# EAGLE design PCB1a_Adapter (EAGLE 9.6.2)
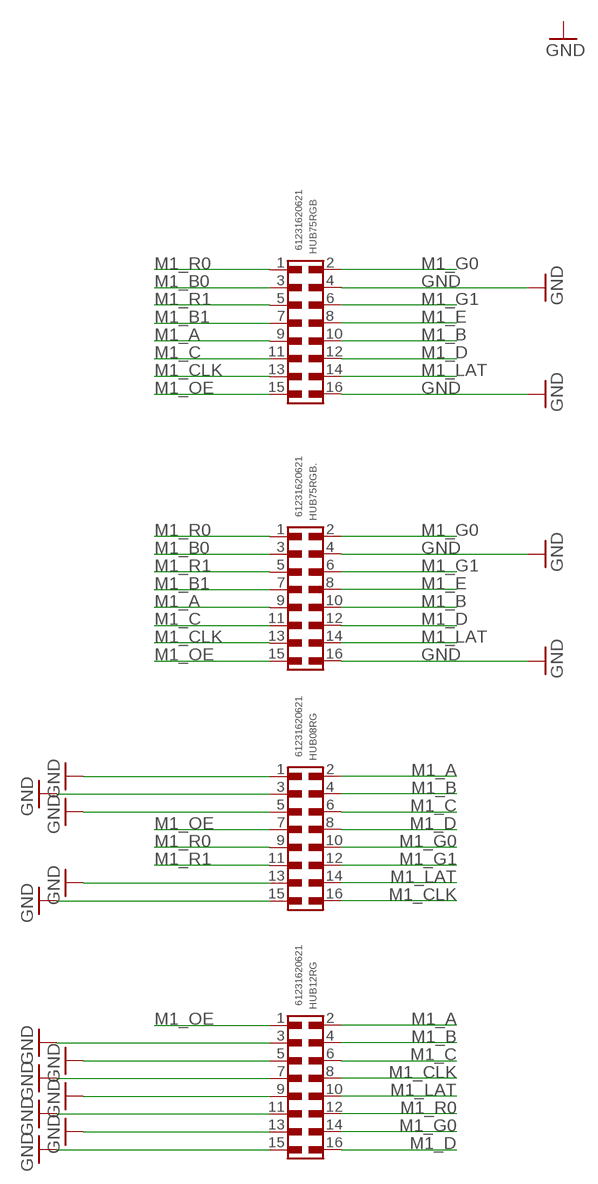
[diagram p0: schematic, sheet 1]

## Parts
HUB08RG  61231620621  6123XX20621_61231620621  [61231620621]
HUB12RG  61231620621  6123XX20621_61231620621  [61231620621]
HUB75RGB  61231620621  6123XX20621_61231620621  [61231620621]
HUB75RGB.  61231620621  6123XX20621_61231620621  [61231620621]

## Nets
GND: HUB08RG.1 HUB08RG.3 HUB08RG.5 HUB08RG.13 HUB08RG.15 HUB12RG.3 HUB12RG.5 HUB12RG.7 HUB12RG.9 HUB12RG.11 HUB12RG.13 HUB12RG.15 HUB75RGB.4 HUB75RGB.16 HUB75RGB..4 HUB75RGB..16
M1_A: HUB08RG.2 HUB12RG.2 HUB75RGB.9 HUB75RGB..9
M1_B: HUB08RG.4 HUB12RG.4 HUB75RGB.10 HUB75RGB..10
M1_B0: HUB75RGB.3 HUB75RGB..3
M1_B1: HUB75RGB.7 HUB75RGB..7
M1_C: HUB08RG.6 HUB12RG.6 HUB75RGB.11 HUB75RGB..11
M1_CLK: HUB08RG.16 HUB12RG.8 HUB75RGB.13 HUB75RGB..13
M1_D: HUB08RG.8 HUB12RG.16 HUB75RGB.12 HUB75RGB..12
M1_E: HUB75RGB.8 HUB75RGB..8
M1_G0: HUB08RG.10 HUB12RG.14 HUB75RGB.2 HUB75RGB..2
M1_G1: HUB08RG.12 HUB75RGB.6 HUB75RGB..6
M1_LAT: HUB08RG.14 HUB12RG.10 HUB75RGB.14 HUB75RGB..14
M1_OE: HUB08RG.7 HUB12RG.1 HUB75RGB.15 HUB75RGB..15
M1_R0: HUB08RG.9 HUB12RG.12 HUB75RGB.1 HUB75RGB..1
M1_R1: HUB08RG.11 HUB75RGB.5 HUB75RGB..5

## Library data of the parts
HUB08RG HUB12RG HUB75RGB HUB75RGB. = Wurth_Connectors_WR-BHD:6123XX20621_61231620621: WR-BHD 2.54 mm Male SMT Box Header Material Properties: Insulator Material PA 9T; PA9T Insulator Flammability Rating UL94 V-0 Color Black Contact Material Copper Alloy Contact Plating Gold Contact Type Stamped General Information Operating Temperature -40 up to +125 °C Compliance RoHS Working Voltage 250 V (AC) Withstanding Voltage 500 V (AC) Contact Resistance 20 mΩ RISO 1000 MΩ Pitch 2.54 mm Gender Male Certification UL Approval E323964 Packaging Properties Packaging Tape and Reel with Cap <https://www.we-online.com/components/media/o32919v209%20Family_WR-BHD_612xxx20621.jpg> Details see: www.we-online.com/en/components/products/BHD_2_54_SMT_MALE_BOX_HEADER_6120XX20621 <www.we-online.com/catalog/BHD_2_54_SMT_MALE_BOX_HEADER_6120XX20621/?utm_source=eagle_model&utm_medium=description_link&utm_campaign=eisos_eagle> Updated by Ella Wu 2022-09-06 2022 (C) Würth Elektronik; CONTACT-RESISTANCE: 20mOhm; DATASHEET-URL: https://www.we-online.com/redexpert/spec/61231620621?ae; GENDER: Male; IR: 3A; LENGTH: 27.94mm; MOUNT: SMT; PACKAGING: Tape and Reel with Cap; PART-NUMBER: 61231620621; PINS: 16; PITCH: 2.54mm; TYPE: Straight; WORKING-VOLTAGE: 250V(AC)

## Net classes
1 power: width 0.305 mm
2 lowpower: width 0.305 mm, drill 0.483 mm

## Board
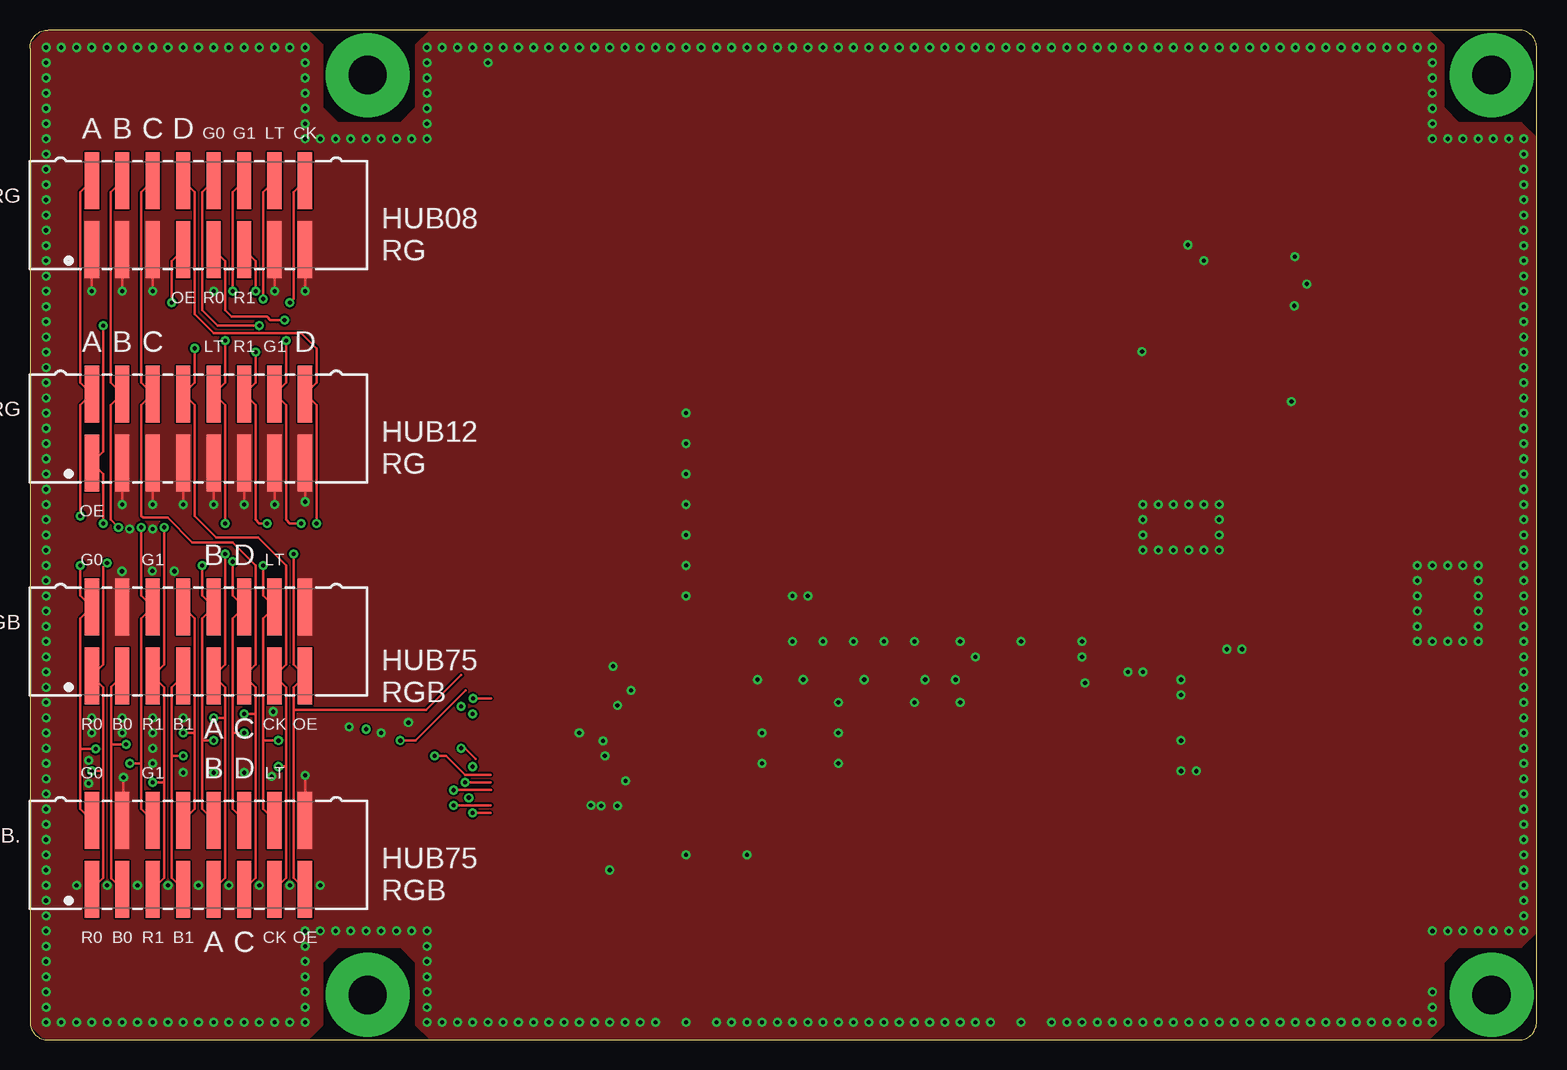
[diagram p1: board, top side]
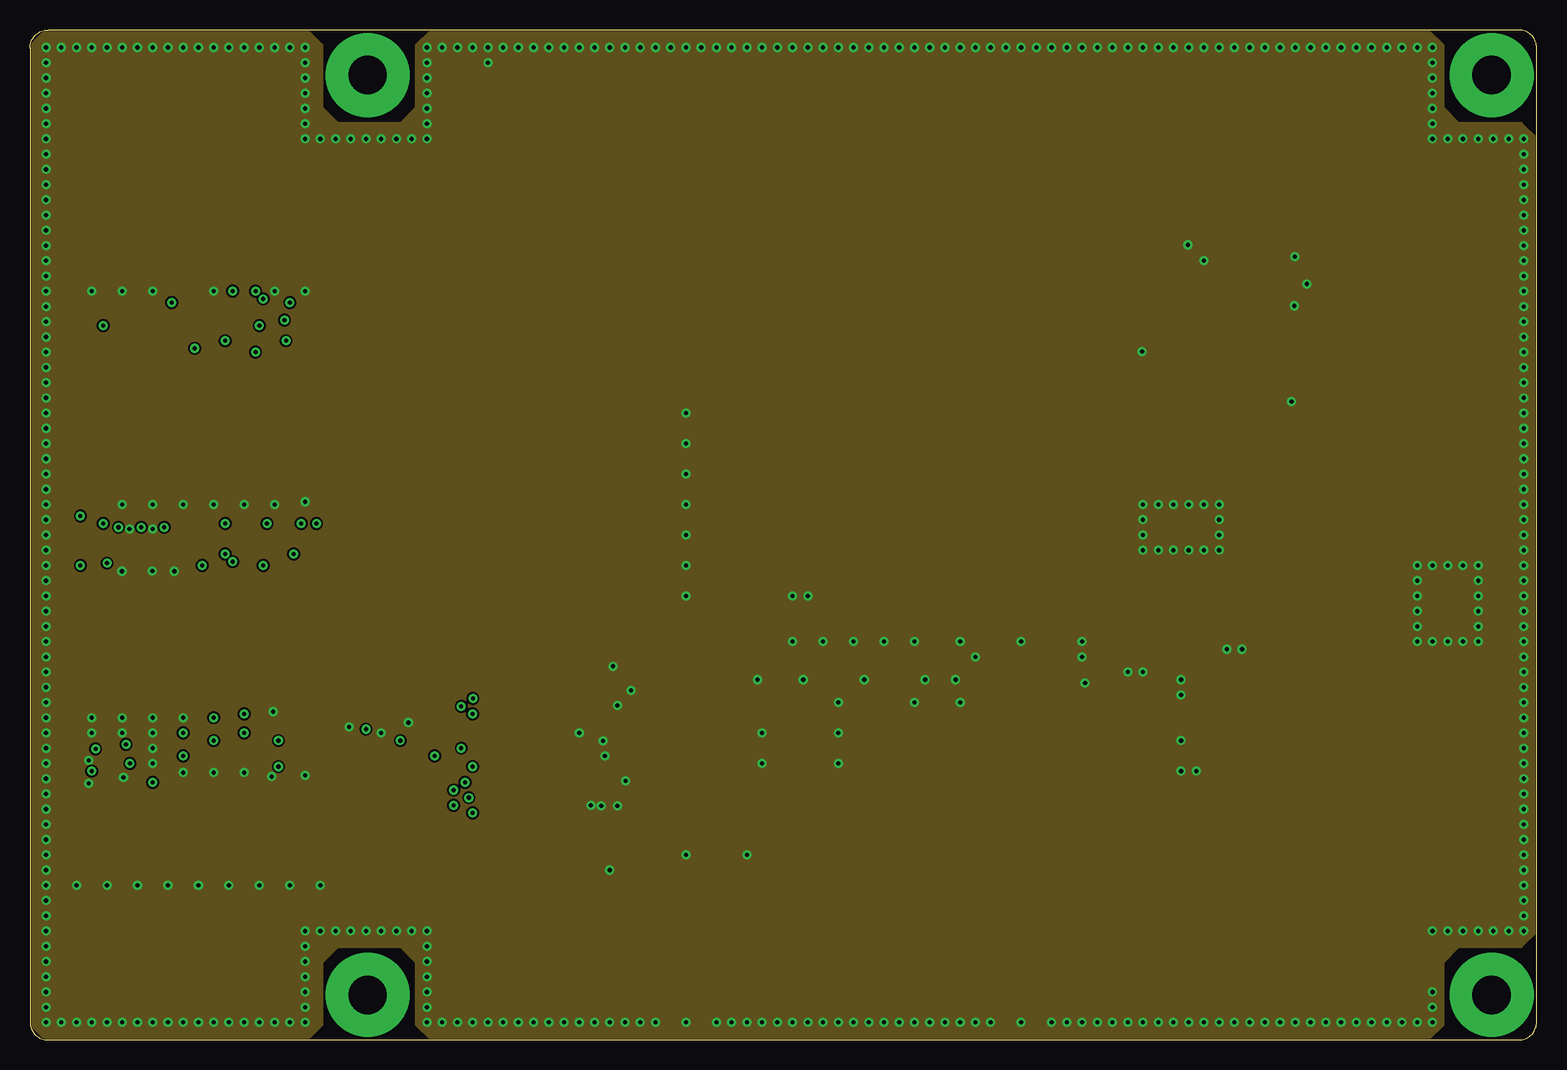
[diagram p2: board, inner layer Route2]
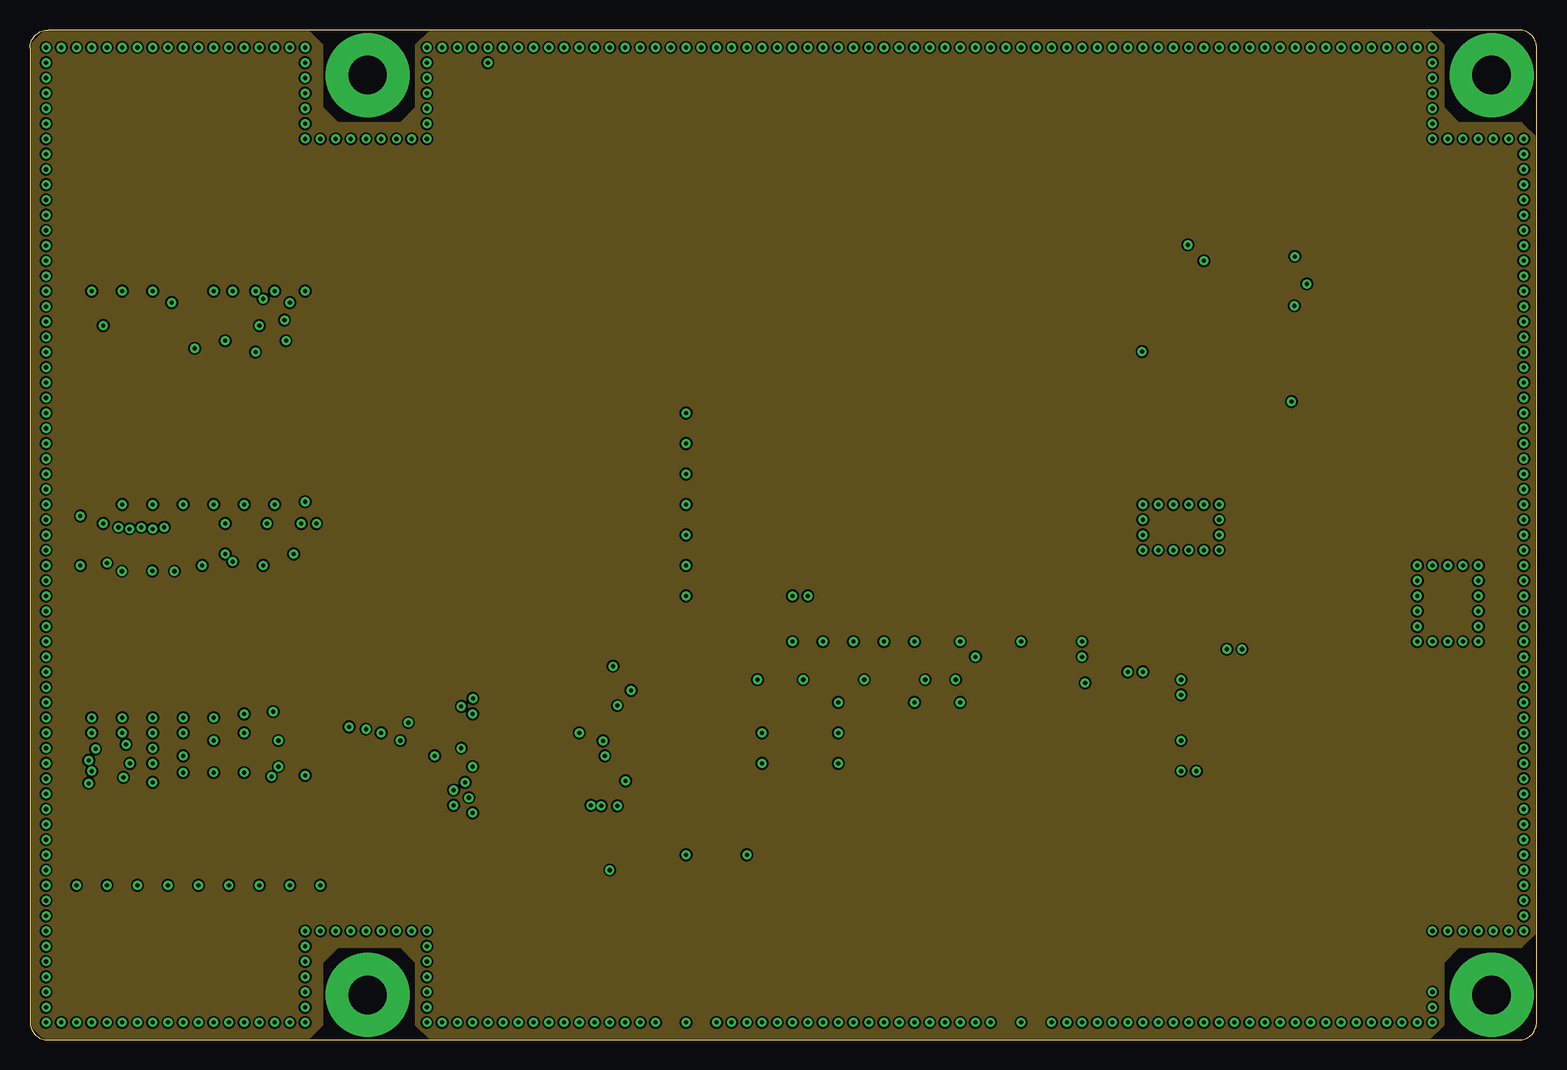
[diagram p3: board, inner layer Route15]
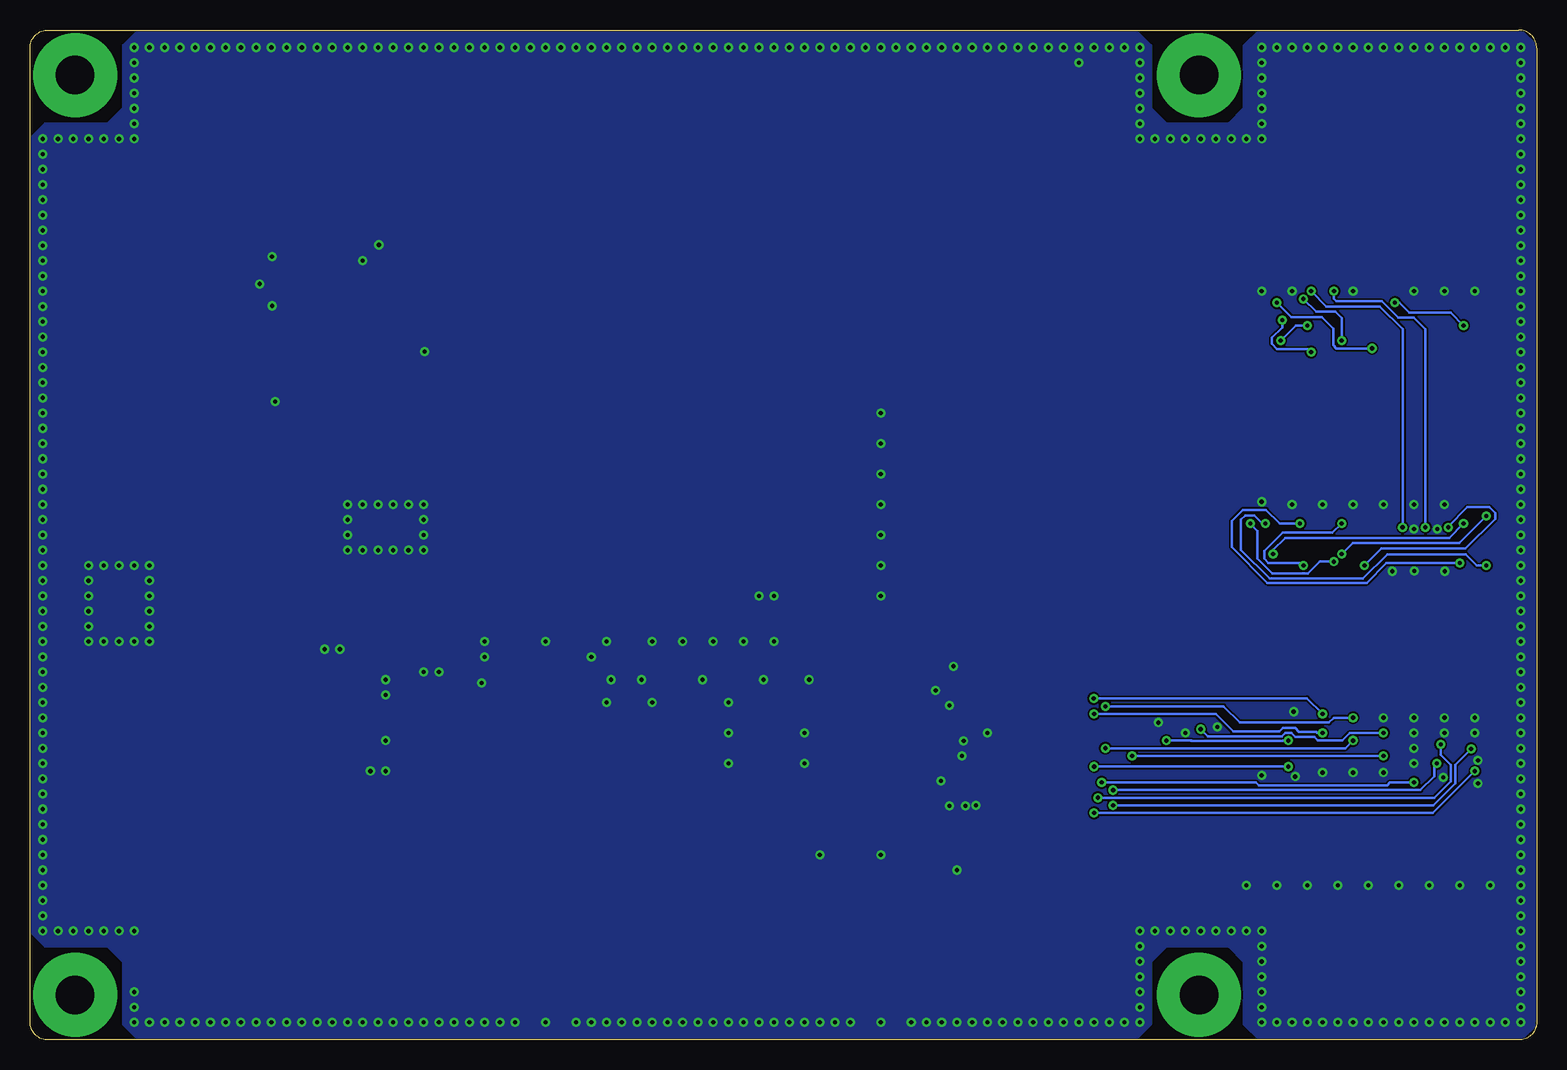
[diagram p4: board, bottom side, seen from below]

Size 125.6 x 84.2 mm. Coordinates in mm from the lower left corner, seen from the top.
Outline: 0,82.7 0,1.5 arc90 1.5,0 124.1,0 arc90 125.6,1.5 125.6,82.7 arc90 124.1,84.2 1.5,84.2 arc90 0,82.7
Copper layers (1*16): Top 0.035mm / dielectric 0.36mm / Bottom 0.035mm
Design rules "default *": minimum track width 6mil, minimum drill 0.35mm, track to track 6mil, track to pad 6mil, pad to pad 6mil, via to via 6mil, smd to smd 6mil, copper to edge 3mil, drill to drill 6mil, minimum pad ring 10mil, minimum via ring 8mil, stop-mask expansion 4mil, vias tented up to drill 15mil, thermal gap 10mil

### Footprints (pad centres in the part's own frame; a part is rotated, then mirrored left to right if it is on the bottom)
61231620621 = smd 1.2 x 4.75: 1 -8.89,-2.875; 2 -8.89,2.875; 3 -6.35,-2.875; 4 -6.35,2.875; 5 -3.81,-2.875; 6 -3.81,2.875; 7 -1.27,-2.875; 8 -1.27,2.875; 9 1.27,-2.875; 10 1.27,2.875; 11 3.81,-2.875; 12 3.81,2.875; 13 6.35,-2.875; 14 6.35,2.875; 15 8.89,-2.875; 16 8.89,2.875

### Placement (x,y rotation side)
HUB08RG  14.04,68.77 0 top
HUB12RG  14.04,50.99 0 top
HUB75RGB  14.04,33.21 0 top
HUB75RGB.  14.04,15.43 0 top

### Tracks (layer width: path | path; a pad name or v marks a point on that pad's centre or on a via)
+5V
  pour Route15: 119.12,7.75 124.33,7.75 125.6,9.02 125.6,75.18 124.33,76.45 119.12,76.45 117.85,77.72 117.85,82.93 116.58,84.2 33.42,84.2 32.15,82.93 32.15,77.72 30.88,76.45 25.67,76.45 24.4,77.72 24.4,82.93 23.13,84.2 1.27,84.2 0,82.93 0,1.27 1.27,0 23.13,0 24.4,1.27 24.4,6.48 25.67,7.75 30.88,7.75 32.15,6.48 32.15,1.27 33.42,0 116.58,0 117.85,1.27 117.85,6.48
GND  (via drill 0.35)
  Top 0.203: v7.79,21.88 7.79,18.41 HUB75RGB..4 | HUB75RGB..16 v22.93,22.06 | HUB08RG.1 v5.15,62.42 | HUB08RG.3 v7.69,62.42 | HUB08RG.5 v10.23,62.42 | HUB08RG.15 v22.93,62.42 | HUB08RG.13 v20.39,62.42 | HUB12RG.3 v7.69,44.64 | HUB12RG.15 v22.93,44.87 | HUB12RG.13 v20.39,44.64 | HUB12RG.11 v17.85,44.64 | HUB12RG.9 v15.31,44.64 | HUB12RG.7 v12.77,44.64 | HUB12RG.5 v10.23,44.64
  other vias: 105.16,53.21 97.86,64.96 61.03,25.59 61.03,23.05 67.38,23.05 67.38,25.59 67.38,28.13 77.54,28.13 73.73,28.13 63.57,33.21 63.57,37.02 1.34,82.74 2.61,82.74 3.88,82.74 5.15,82.74 6.42,82.74 7.69,82.74 8.96,82.74 10.23,82.74 11.5,82.74 12.77,82.74 14.04,82.74 15.31,82.74 16.58,82.74 17.85,82.74 22.93,82.74 21.66,82.74 20.39,82.74 19.12,82.74 33.09,82.74 34.36,82.74 35.63,82.74 36.9,82.74 38.17,82.74 39.44,82.74 40.71,82.74 41.98,82.74 43.25,82.74 44.52,82.74 45.79,82.74 47.06,82.74 48.33,82.74 49.6,82.74 1.34,81.47 1.34,80.2 1.34,78.93 1.34,77.66 1.34,76.39 1.34,75.12 60.65,30.04 64.46,30.04 69.54,30.04 74.62,30.04 77.16,30.04 47.77,24.93 45.79,25.59 47.92,23.69 5.15,25.59 5.15,26.86 7.69,26.86 7.69,25.59 10.23,25.59 10.23,26.86 12.77,26.86 10.23,24.32 10.23,23.05 12.77,22.29 15.31,22.29 17.85,22.29 20.14,21.96 48.97,27.88 66.11,33.21 68.65,33.21 71.19,33.21 73.73,33.21 77.54,33.21 78.81,31.94 50.11,29.15 48.61,31.15 64.84,37.02 92.78,44.64 92.78,43.37 92.78,42.1 92.78,40.83 94.05,40.83 99.13,40.83 99.13,42.1 99.13,43.37 99.13,44.64 97.86,44.64 96.59,44.64 95.32,44.64 94.05,44.64 95.32,40.83 96.59,40.83 97.86,40.83 115.64,34.48 115.64,35.75 115.64,37.02 115.64,38.29 115.64,39.56 116.91,39.56 118.18,39.56 119.45,39.56 120.72,39.56 120.72,38.29 120.72,37.02 120.72,35.75 120.72,34.48 120.72,33.21 119.45,33.21 118.18,33.21 116.91,33.21 115.64,33.21 50.87,82.74 52.14,82.74 53.41,82.74 54.68,82.74 55.95,82.74 57.22,82.74 58.49,82.74 59.76,82.74 61.03,82.74 62.3,82.74 63.57,82.74 64.84,82.74 66.11,82.74 67.38,82.74 86.43,82.74 87.7,82.74 88.97,82.74 90.24,82.74 91.51,82.74 92.78,82.74 94.05,82.74 95.32,82.74 96.59,82.74 97.86,82.74 99.13,82.74 100.4,82.74 101.67,82.74 102.94,82.74 68.65,82.74 69.92,82.74 71.19,82.74 72.46,82.74 73.73,82.74 75,82.74 76.27,82.74 77.54,82.74 78.81,82.74 80.08,82.74 81.35,82.74 82.62,82.74 83.89,82.74 85.16,82.74 104.21,82.74 105.48,82.74 106.75,82.74 108.02,82.74 109.29,82.74 110.56,82.74 111.83,82.74 113.1,82.74 114.37,82.74 115.64,82.74 116.91,82.74 22.93,81.47 22.93,80.2 22.93,78.93 22.93,77.66 22.93,76.39 33.09,81.47 33.09,80.2 33.09,78.93 33.09,77.66 33.09,76.39 33.09,75.12 31.82,75.12 30.55,75.12 29.28,75.12 28.01,75.12 26.74,75.12 25.47,75.12 24.2,75.12 22.93,75.12 28.01,9.08 29.28,9.08 30.55,9.08 31.82,9.08 33.09,9.08 33.09,7.81 33.09,6.54 33.09,5.27 22.93,6.54 22.93,7.81 22.93,9.08 24.2,9.08 25.47,9.08 26.74,9.08 22.93,5.27 22.93,4 22.93,2.73 22.93,1.46 21.66,1.46 20.39,1.46 33.09,1.46 34.36,1.46 35.63,1.46 33.09,2.73 33.09,4 4.9,21.4 4.9,23.3 6.42,12.89 11.5,12.89 16.58,12.89 19.12,12.89 21.66,12.89 24.2,12.89 3.88,12.89 8.96,12.89 14.04,12.89 19.12,1.46 17.85,1.46 1.34,1.46 1.34,2.73 1.34,4 1.34,5.27 36.9,1.46 38.17,1.46 39.44,1.46 40.71,1.46 41.98,1.46 43.25,1.46 44.52,1.46 45.79,1.46 47.06,1.46 48.33,1.46 49.6,1.46 50.87,1.46 52.14,1.46 54.68,1.46 57.22,1.46 58.49,1.46 59.76,1.46 61.03,1.46 62.3,1.46 63.57,1.46 64.84,1.46 66.11,1.46 67.38,1.46 86.43,1.46 87.7,1.46 88.97,1.46 90.24,1.46 91.51,1.46 92.78,1.46 94.05,1.46 95.32,1.46 96.59,1.46 97.86,1.46 99.13,1.46 100.4,1.46 101.67,1.46 102.94,1.46 68.65,1.46 69.92,1.46 71.19,1.46 72.46,1.46 73.73,1.46 75,1.46 76.27,1.46 77.54,1.46 78.81,1.46 80.08,1.46 82.62,1.46 85.16,1.46 104.21,1.46 105.48,1.46 106.75,1.46 108.02,1.46 109.29,1.46 110.56,1.46 111.83,1.46 113.1,1.46 114.37,1.46 115.64,1.46 16.58,1.46 15.31,1.46 14.04,1.46 12.77,1.46 2.61,1.46 3.88,1.46 1.34,6.54 1.34,7.81 1.34,9.08 1.34,10.35 1.34,11.62 1.34,12.89 1.34,14.16 1.34,15.43 1.34,16.7 1.34,17.97 1.34,19.24 1.34,20.51 1.34,21.78 1.34,23.05 1.34,24.32 1.34,25.59 1.34,44.64 1.34,45.91 1.34,47.18 1.34,48.45 1.34,49.72 1.34,50.99 1.34,52.26 1.34,53.53 1.34,54.8 1.34,56.07 1.34,57.34 1.34,58.61 1.34,59.88 1.34,61.15 1.34,26.86 1.34,28.13 1.34,29.4 1.34,30.67 1.34,31.94 1.34,33.21 1.34,34.48 1.34,35.75 1.34,37.02 1.34,38.29 1.34,39.56 1.34,40.83 1.34,42.1 1.34,43.37 1.34,62.42 1.34,63.69 1.34,64.96 1.34,66.23 1.34,67.5 1.34,68.77 1.34,70.04 1.34,71.31 1.34,72.58 1.34,73.85 11.5,1.46 10.23,1.46 8.96,1.46 7.69,1.46 6.42,1.46 5.15,1.46 118.18,9.08 119.45,9.08 120.72,9.08 121.99,9.08 123.26,9.08 116.91,2.73 116.91,1.46 116.91,4 116.91,9.08 124.53,9.08 124.53,10.35 124.53,11.62 124.53,12.89 124.53,14.16 124.53,15.43 124.53,16.7 124.53,17.97 124.53,19.24 124.53,20.51 124.53,21.78 124.53,23.05 124.53,24.32 124.53,25.59 124.53,26.86 124.53,28.13 124.53,29.4 124.53,30.67 124.53,49.72 124.53,50.99 124.53,52.26 124.53,53.53 124.53,54.8 124.53,56.07 124.53,57.34 124.53,58.61 124.53,59.88 124.53,61.15 124.53,62.42 124.53,63.69 124.53,64.96 124.53,66.23 124.53,31.94 124.53,33.21 124.53,34.48 124.53,35.75 124.53,37.02 124.53,38.29 124.53,39.56 124.53,40.83 124.53,42.1 124.53,43.37 124.53,44.64 124.53,45.91 124.53,47.18 124.53,48.45 124.53,67.5 124.53,68.77 124.53,70.04 124.53,71.31 124.53,72.58 124.53,73.85 124.53,75.12 116.91,81.47 123.26,75.12 121.99,75.12 120.72,75.12 116.91,80.2 116.91,78.93 116.91,77.66 116.91,76.39 116.91,75.12 118.18,75.12 119.45,75.12 99.77,32.58 101.03,32.58 95.95,28.77 95.95,30.04 87.7,31.94 95.95,24.96 97.22,22.42 95.95,22.42 8.3,42.61 10.23,42.61 10.2,39.1 12.03,39.08 7.66,39.08 29.28,25.59 31.54,26.45 26.61,26.1 20.26,27.37 106.45,63.03 105.43,65.32 105.4,61.2 92.7,57.39 96.51,66.28 87.95,29.76 46.76,19.54 47.62,19.52 48.97,19.52 49.65,21.6 54.68,52.26 54.68,49.72 54.68,47.18 54.68,44.64 54.68,42.1 54.68,39.56 54.68,37.02 54.68,15.43 59.76,15.43 48.33,14.16 38.17,81.47 82.62,33.21 87.7,33.21 15.31,62.42 92.78,30.67 91.51,30.67
  pour Bottom: 119.12,7.75 124.33,7.75 125.6,9.02 125.6,75.18 124.33,76.45 119.12,76.45 117.85,77.72 117.85,82.93 116.58,84.2 33.42,84.2 32.15,82.93 32.15,77.72 30.88,76.45 25.67,76.45 24.4,77.72 24.4,82.93 23.13,84.2 1.27,84.2 0,82.93 0,1.27 1.27,0 23.13,0 24.4,1.27 24.4,6.48 25.67,7.75 30.88,7.75 32.15,6.48 32.15,1.27 33.42,0 116.58,0 117.85,1.27 117.85,6.48
  pour Top: 119.12,7.75 124.33,7.75 125.6,9.02 125.6,75.18 124.33,76.45 119.12,76.45 117.85,77.72 117.85,82.93 116.58,84.2 33.42,84.2 32.15,82.93 32.15,77.72 30.88,76.45 25.67,76.45 24.4,77.72 24.4,82.93 23.13,84.2 1.27,84.2 0,82.93 0,1.27 1.27,0 23.13,0 24.4,1.27 24.4,6.48 25.67,7.75 30.88,7.75 32.15,6.48 32.15,1.27 33.42,0 116.58,0 117.85,1.27 117.85,6.48
  pour Route2: 119.12,7.75 124.33,7.75 125.6,9.02 125.6,75.18 124.33,76.45 119.12,76.45 117.85,77.72 117.85,82.93 116.58,84.2 33.42,84.2 32.15,82.93 32.15,77.72 30.88,76.45 25.67,76.45 24.4,77.72 24.4,82.93 23.13,84.2 1.27,84.2 0,82.93 0,1.27 1.27,0 23.13,0 24.4,1.27 24.4,6.48 25.67,7.75 30.88,7.75 32.15,6.48 32.15,1.27 33.42,0 116.58,0 117.85,1.27 117.85,6.48
M1_A  (via drill 0.35)
  Top 0.203: HUB75RGB..9 16.26,13.51 16.26,26.86 | 16.26,26.86 16.26,29.38 HUB75RGB.9 16.26,31.29 v16.26,40.51 | v35.95,27.82 v35.95,27.81 | v15.31,26.86 16.26,26.86 | HUB08RG.2 4.2,70.69 4.2,54.82 HUB12RG.2 4.2,52.91 v4.2,43.69
  Bottom 0.203: v15.31,26.86 16.93,26.86 17.32,26.47 24.76,26.47 26.1,27.81 v35.95,27.81 | v4.2,43.69 6.45,41.43 15.34,41.43 v16.26,40.51
M1_B  (via drill 0.35)
  Top 0.203: HUB75RGB..10 14.36,19.26 14.36,24.96 | 14.36,24.96 14.36,35.13 HUB75RGB.10 14.36,37.04 v14.36,39.56 | 37.15,23.44 36.27,24.32 v35.95,24.32 | v15.31,24.96 14.36,24.96 | HUB08RG.4 6.74,70.69 6.74,54.82 HUB12RG.4 6.74,52.91 6.74,43.37 v7.37,42.73
  Bottom 0.203: v35.95,24.32 15.95,24.32 v15.31,24.96 | v7.37,42.73 7.37,42.82 5.77,44.42 3.95,44.42 3.46,43.94 3.46,43.44 5.94,40.96 12.96,40.96 v14.36,39.56
M1_B0  (via drill 0.35)
  Top 0.203: HUB75RGB..3 6.79,13.46 6.79,24.64 | HUB75RGB.3 6.79,29.43 6.79,24.64 | v36.59,20.19 v36.58,20.19 | v8.01,24.64 6.79,24.64
  Bottom 0.203: v36.58,20.19 8.52,20.19 7.16,21.55 7.16,22.92 8.01,23.77 v8.01,24.64
M1_B1  (via drill 0.35)
  Top 0.203: HUB75RGB..7 11.82,13.51 11.82,23.69 | HUB75RGB.7 11.82,29.38 11.82,23.69 | 38.39,22.1 36.27,22.1 34.68,23.69 v33.73,23.69 | v12.77,23.69 11.82,23.69
  Bottom 0.203: v33.73,23.69 v12.77,23.69
M1_C  (via drill 0.35)
  Top 0.203: HUB75RGB..11 18.8,13.51 18.8,27.18 | 18.8,27.18 18.8,29.38 HUB75RGB.11 18.8,31.29 18.8,39.56 16.9,41.47 13.54,41.47 11.46,43.55 9.42,43.55 9.28,43.69 9.28,52.91 HUB12RG.6 9.28,54.82 9.28,70.69 HUB08RG.6 | 38.42,28.47 v36.92,28.47 | v17.85,27.18 18.8,27.18
  Bottom 0.203: v36.92,28.47 19.15,28.47 v17.85,27.18
M1_CLK  (via drill 0.35)
  Top 0.203: HUB75RGB..13 21.34,13.51 21.34,22.79 | 21.34,22.79 21.34,29.38 HUB75RGB.13 21.34,31.29 21.34,39.56 19.01,41.9 15.51,41.9 13.72,43.69 13.72,52.91 HUB12RG.8 13.72,54.82 v13.72,57.66 | v20.71,22.79 21.34,22.79 | HUB08RG.16 21.98,70.69 21.98,61.78 v21.66,61.47
  Bottom 0.203: v36.9,22.79 v20.71,22.79 | v21.66,61.47 20.45,60.26 17.91,60.26 16.95,59.29 16.95,57.91 16.69,57.66 v13.72,57.66
M1_D  (via drill 0.35)
  Top 0.203: HUB75RGB..12 16.9,19.26 16.9,25.59 | 16.9,25.59 16.9,35.13 HUB75RGB.12 16.9,37.04 16.9,39.88 v16.91,39.87 | v36.91,27.17 v36.9,27.18 | v17.85,25.59 16.9,25.59 | HUB08RG.8 13.72,70.69 13.72,60.52 15.31,58.93 22.61,58.93 23.88,57.66 23.88,54.82 HUB12RG.16 23.88,52.91 v23.88,43.05
  Bottom 0.203: v36.9,27.18 26.74,27.18 25.27,25.7 21.47,25.7 21.18,25.99 20.13,25.99 19.82,25.68 18.37,25.68 18.28,25.59 v17.85,25.59 | v16.91,39.87 18.09,39.87 19.06,38.9 22.04,38.9 23.27,40.13 23.27,42.44 v23.88,43.05
M1_E  (via drill 0.35)
  Top 0.203: HUB75RGB..8 13.72,19.26 13.72,25.59 | HUB75RGB.8 13.72,35.13 13.72,25.59 | v12.77,25.59 13.72,25.59
  Bottom 0.203: v28.01,25.91 27.4,25.3 21.26,25.3 20.97,25.59 20.45,25.59 20.13,25.27 18.55,25.27 18.24,24.96 16.2,24.96 15.57,25.59 v12.77,25.59
M1_G0  (via drill 0.35)
  Top 0.203: HUB75RGB..2 4.2,19.26 4.2,24.26 | 4.2,24.26 4.2,35.13 HUB75RGB.2 4.2,37.04 v4.2,39.56 | 38.41,19.56 v35.31,19.56 | v5.47,24.26 4.2,24.26 | HUB08RG.10 14.36,70.69 14.36,60.83 15.63,59.56 v19.12,59.56 | v21.34,58.29 21.34,54.82 HUB12RG.14 21.34,52.91 21.34,43.37 21.66,43.05 v22.61,43.05
  Bottom 0.203: v5.47,24.26 6.78,22.95 6.78,21.4 8.62,19.56 v35.31,19.56 | v19.12,59.56 20.07,59.56 v21.34,58.29 | v22.61,43.05 22.87,43.05 23.55,43.73 24.29,43.73 24.64,43.38 24.64,40.85 22.27,38.47 14.49,38.47 12.47,40.48 5.92,40.48 4.99,39.56 v4.2,39.56
M1_G1  (via drill 0.35)
  Top 0.203: HUB75RGB..6 9.28,19.26 9.28,23.05 | 9.28,23.05 9.28,35.13 HUB75RGB.6 9.28,37.04 v9.28,42.73 | 38.42,20.83 v35.31,20.83 | v8.33,23.05 9.28,23.05 | HUB08RG.12 16.9,70.69 v16.9,62.42
  Bottom 0.203: v8.33,23.05 8.56,22.82 8.56,21.96 9.69,20.83 v35.31,20.83 | v16.9,62.42 16.9,61.78 16.71,61.59 12.93,61.59 11.55,60.21 10.24,60.21 9.28,59.25 v9.28,42.73
M1_LAT  (via drill 0.35)
  Top 0.203: HUB75RGB..14 19.44,19.26 19.44,24.96 | 19.44,24.96 19.44,35.13 HUB75RGB.14 19.44,37.04 v19.44,39.56 | HUB08RG.14 19.44,70.69 19.44,61.78 v19.45,61.78 | 36.3,29.12 32.14,24.96 v30.87,24.96 | v20.71,24.96 19.44,24.96 | v16.26,58.29 16.26,54.82 HUB12RG.10 16.26,52.91 v16.26,43.05
  Bottom 0.203: v19.45,61.78 18.37,60.7 16.77,60.7 16.26,60.2 v16.26,58.29 | v16.26,43.05 17.02,42.29 21.18,42.29 22.71,40.76 22.71,40.13 22.36,39.78 19.66,39.78 v19.44,39.56 | v30.87,24.96 28.79,24.96 28.78,24.94 21.15,24.94 21.13,24.96 v20.71,24.96
M1_OE  (via drill 0.35)
  Top 0.203: HUB75RGB..15 21.98,13.51 21.98,27.51 | 21.98,27.51 21.98,29.38 HUB75RGB.15 21.98,31.29 v21.98,40.51 | HUB08RG.7 11.82,64.94 v11.82,61.47 | 21.98,27.51 33.04,27.51 35.95,30.42 | v6.1,59.56 6.1,49.07 HUB12RG.1 6.1,47.16 v6.1,43.05
  Bottom 0.203: v11.82,61.47 11.44,61.47 10.61,60.64 7.18,60.64 v6.1,59.56 | v6.1,43.05 7.29,41.86 20.95,41.86 21.98,40.83 v21.98,40.51
M1_R0  (via drill 0.35)
  Top 0.203: HUB75RGB..1 6.1,13.51 6.1,22.42 | 6.1,22.42 6.1,29.38 HUB75RGB.1 6.1,31.29 6.1,39.43 v6.42,39.75 | 38.39,18.92 v36.9,18.92 | v5.15,22.42 6.1,22.42 | HUB08RG.9 16.26,64.94 16.26,60.83 16.8,60.3 19.75,60.3 20.04,60.01 v21.22,60.01 | v18.8,57.34 18.8,54.82 HUB12RG.12 18.8,52.91 18.8,43.37 19.12,43.05 v19.76,43.05
  Bottom 0.203: v36.9,18.92 8.64,18.92 v5.15,22.42 | v21.22,60.01 21.22,59.41 22.08,58.54 22.08,58.04 21.65,57.61 19.07,57.61 v18.8,57.34 | v19.76,43.05 21.42,43.05 22.56,44.19 24.49,44.19 25.4,43.28 25.4,41.08 22.44,38.12 14.16,38.12 12.52,39.75 v6.42,39.75
M1_R1  (via drill 0.35)
  Top 0.203: HUB75RGB..5 11.18,13.51 11.18,21.46 | 11.18,21.46 11.18,29.38 HUB75RGB.5 11.18,31.29 v11.18,42.73 | 38.41,21.46 v36.27,21.46 | v10.23,21.46 11.18,21.46 | HUB08RG.11 18.8,64.94 v18.8,62.42
  Bottom 0.203: v36.27,21.46 23.42,21.46 23.18,21.22 12.47,21.22 12.23,21.46 v10.23,21.46 | v18.8,62.42 17.53,61.15 13.09,61.15 11.18,59.25 v11.18,42.73
MOUNT1  (via drill 3.2 pad 7)
  other vias: 121.85,80.45
MOUNT2  (via drill 3.2 pad 7)
  other vias: 121.85,3.75
MOUNT3  (via drill 3.2 pad 7)
  other vias: 28.15,80.45
MOUNT4  (via drill 3.2 pad 7)
  other vias: 28.15,3.75

### Text on the board
tPlace: HUB08 / RG | HUB12 / RG | HUB75 / RGB | HUB75 / RGB
tNames: A | B | C | D | G0 | G1 | LT | CK | OE | R0 | R1 | A | B | C | LT | R1 | G1 | D | OE | G0 | G1 | B | D | LT | R0 | B0 | R1 | B1 | A | C | CK | OE | G0 | G1 | B | D | LT | R0 | B0 | R1 | B1 | A | C | CK | OE
214bmp: D:/SmartProjects/Snc/a4_bn_logo2.bmp